# EAGLE schematic MachTestNguonSanXuat31072019 (EAGLE 6.1)
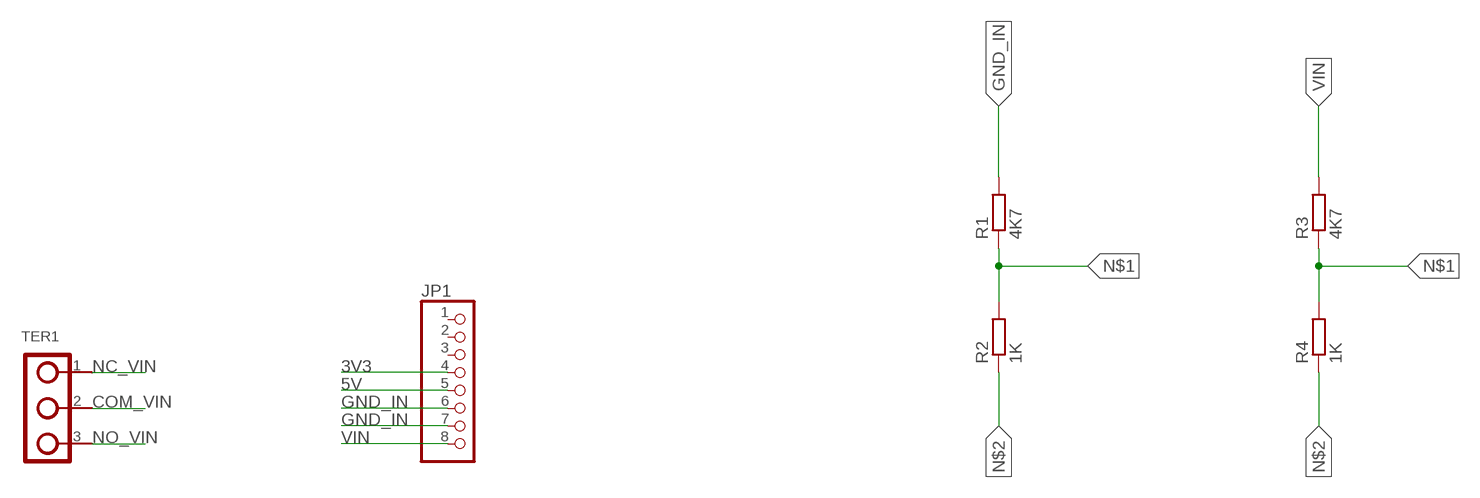
[diagram p0: schematic, sheet 1]

## Parts
JP1  PINHD-1X8CLEANBIG  [1X08-CLEANBIG]
R1  4K7  RCL_R-EU_R0603  [RCL_R0603]
R2  1K  RCL_R-EU_R0603  [RCL_R0603]
R3  4K7  RCL_R-EU_R0603  [RCL_R0603]
R4  1K  RCL_R-EU_R0603  [RCL_R0603]
TER1  DOMINO-3  [DOMINO-3]

## Nets
3V3: JP1.4
5V: JP1.5
COM_VIN: TER1.2
GND_IN: JP1.6 JP1.7 R1.2
N$1: R1.1 R2.2 R3.1 R4.2
N$2: R2.1 R4.1
NC_VIN: TER1.1
NO_VIN: TER1.3
VIN: JP1.8 R3.2
Unconnected: JP1.1 JP1.2 JP1.3

## Library data of the parts
JP1 = adafruit:PINHD-1X8: PIN HEADER
R1-R4 = MakerShop:RCL_R-EU_: RESISTOR, European symbol
TER1 = chuong:DOMINO-3